# EAGLE design p7.1_3v3 (EAGLE 9.3.0)
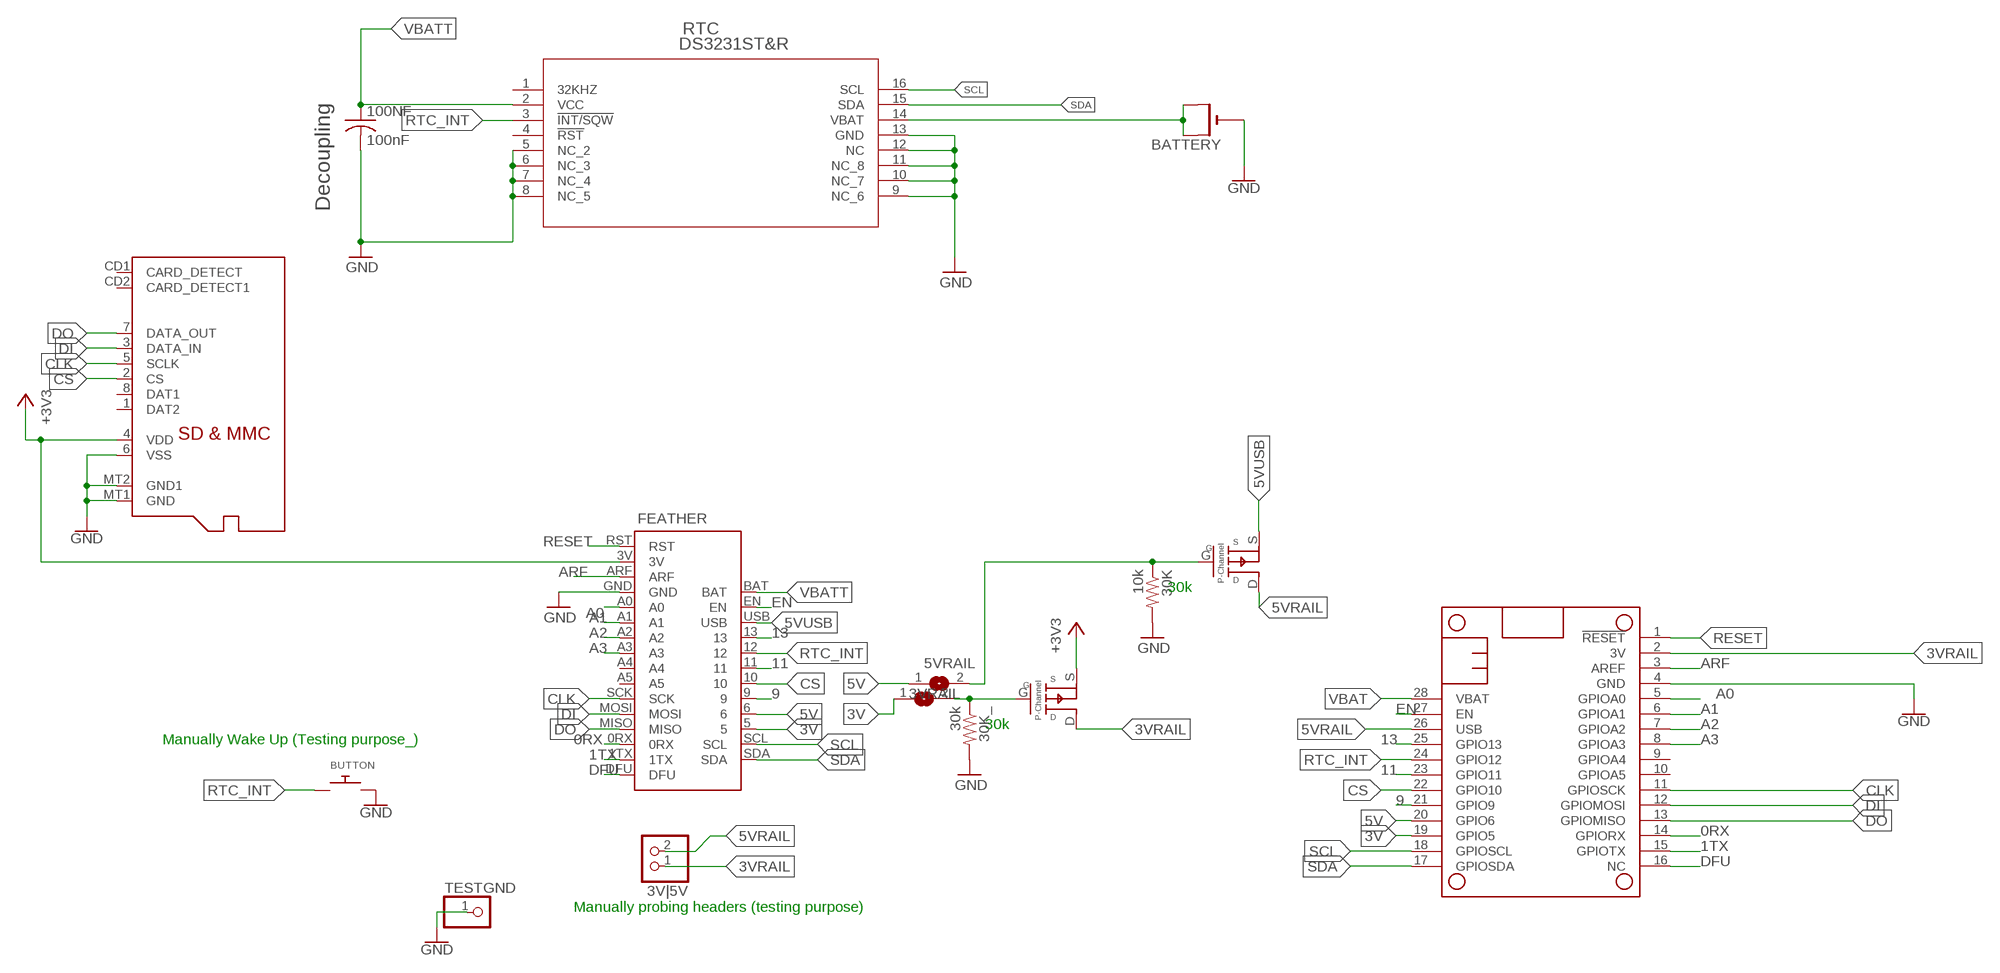
[diagram p0: schematic, sheet 1]

## Parts
3VRAIL  SJ  [SJ]
3V|5V  PINHD-1X2  [1X02]
5VRAIL  SJ  [SJ]
30K  10k  R-US_R1206  [R1206]
30K_  30k  R-US_R1206  [R1206]
100NF  100nF  C-USC1206  [C1206]
BATTERY  CR1220SMT  [CR1220-SMD]
BUTTON  SWITCH_PUSHBUTTONSOFTTOUCHSMD_SJ  [PUSHBUTTON_SMD_SJ]
FEATHER  BLUEFRUIT_M0  [BLUEFRUIT_MO]
MICROSD  MICROSD  [MICROSD]
MS1  FEATHERWING  [FEATHERWING]
PMOS  SSM3J3228R  [SOT-23-3]
PMOS_  SSM3J3228R  [SOT-23-3]
RTC  DS3231ST&R  [21-0042B_16]
TESTGND  PINHD-1X1  [1X01]

## Nets
0RX: FEATHER.0RX MS1.14(GPIORX)
1TX: FEATHER.1TX MS1.15(GPIOTX)
3V: 3VRAIL.1 FEATHER.5 MS1.19(GPIO5)
3VRAIL: 3V|5V.1 MS1.2(3V) PMOS.D
5V: 5VRAIL.1 FEATHER.6 MS1.20(GPIO6)
5VRAIL: 3V|5V.2 5VRAIL.2 30K.1 MS1.26(USB) PMOS_.D PMOS_.G
5VUSB: FEATHER.USB PMOS_.S
9: FEATHER.9 MS1.21(GPIO9)
11: FEATHER.11 MS1.23(GPIO11)
13: FEATHER.13 MS1.25(GPIO13)
+3V3: FEATHER.3V MICROSD.4(VDD) PMOS.S
A0: FEATHER.A0 MS1.5(GPIOA0)
A1: FEATHER.A1 MS1.6(GPIOA1)
A2: FEATHER.A2 MS1.7(GPIOA2)
A3: FEATHER.A3 MS1.8(GPIOA3)
ARF: FEATHER.ARF MS1.3(AREF)
CLK: FEATHER.SCK MICROSD.5(SCLK) MS1.11(GPIOSCK)
CS: FEATHER.10 MICROSD.2(CS) MS1.22(GPIO10)
DFU: FEATHER.DFU MS1.16(NC)
DI: FEATHER.MOSI MICROSD.3(DATA_IN) MS1.12(GPIOMOSI)
DO: FEATHER.MISO MICROSD.7(DATA_OUT) MS1.13(GPIOMISO)
EN: FEATHER.EN MS1.27(EN)
GND: 30K.2 30K_.2 100NF.2 BATTERY.- BUTTON.P$2 FEATHER.GND MICROSD.6(VSS) MICROSD.MT1(GND) MICROSD.MT2(GND1) MS1.4(GND) RTC.5(NC_2) RTC.6(NC_3) RTC.7(NC_4) RTC.8(NC_5) RTC.9(NC_6) RTC.10(NC_7) RTC.11(NC_8) RTC.12(NC) RTC.13(GND) TESTGND.1
N$2: BATTERY.+$1(+) BATTERY.+$2(+1) RTC.14(VBAT)
OUTPUT3V3: 3VRAIL.2 30K_.1 PMOS.G
RESET: FEATHER.RST MS1.1(!RESET)
RTC_INT [sig]: BUTTON.P$1 FEATHER.12 MS1.24(GPIO12) RTC.3(!INT/SQW)
SCL: FEATHER.SCL MS1.18(GPIOSCL) RTC.16(SCL)
SDA: FEATHER.SDA MS1.17(GPIOSDA) RTC.15(SDA)
VBAT [sig]: MS1.28(VBAT)
VBATT [sig]: 100NF.1 FEATHER.BAT RTC.2(VCC)
Unconnected: FEATHER.A4 FEATHER.A5 MICROSD.1(DAT2) MICROSD.8(DAT1) MICROSD.CD1(CARD_DETECT) MICROSD.CD2(CARD_DETECT1) MS1.9(GPIOA4) MS1.10(GPIOA5) RTC.1(32KHZ) RTC.4(!RST)

## Notes on the sheet
- Decoupling
- 30k
- 30k
- Manually Wake Up (Testing purpose_)
- Manually probing headers (testing purpose)

## Library data of the parts
3VRAIL 5VRAIL = jumper:SJ: SMD solder JUMPER
3V|5V = pinhead:PINHD-1X2: PIN HEADER
30K 30K_ = adafruit:R-US_: RESISTOR, American symbol
100NF = adafruit:C-US: CAPACITOR, American symbol
BATTERY = adafruit:CR1220: CR1216/CR1220/CR1225 12mm 3V lithium coin cell Great for battery packup. Both SMT and THM holders. Note the THM package has the ground pads on both sides of the PCB so that the masks are the same - this reduces the cost
BUTTON = adafruit:SWITCH_PUSHBUTTON: Buttons SOFTTOUCHSMD_SJ - Soft touch temporary push button (Super Junk Akihabara) Compatible with SKPMANE010 [Mouser: 688-SKPMAN] C&K_KSS = Digikey: KSS221GLFS
FEATHER = bluefruit_m0:BLUEFRUIT_M0: Adafruit's M0 Bluefruit / Bluetooth board layout
MICROSD = adafruit:MICROSD: Micro-SD / Transflash card holder with SPI pinout For the 3M # 2908-05WB-MG and/or 4UCON #19656 push-push type
MS1 = powerboard:FEATHERWING
PMOS PMOS_ = M0_Power:SSM3J3228R: P-Channel MOSFET, SOT-23-3 SMD Package
RTC = power8:DS3231ST&R: DS3231 RTC IC only; MANUFACTURER_PART_NUMBER: DS3231S#T&R; VENDOR: Maxim Integrated Products
TESTGND = adafruitmodified:PINHD-1X1: Pin header 1x1 for 0.1" spacing With round pins

## Net classes
3 sig: width 0.152 mm, clearance 0.152 mm

## Board
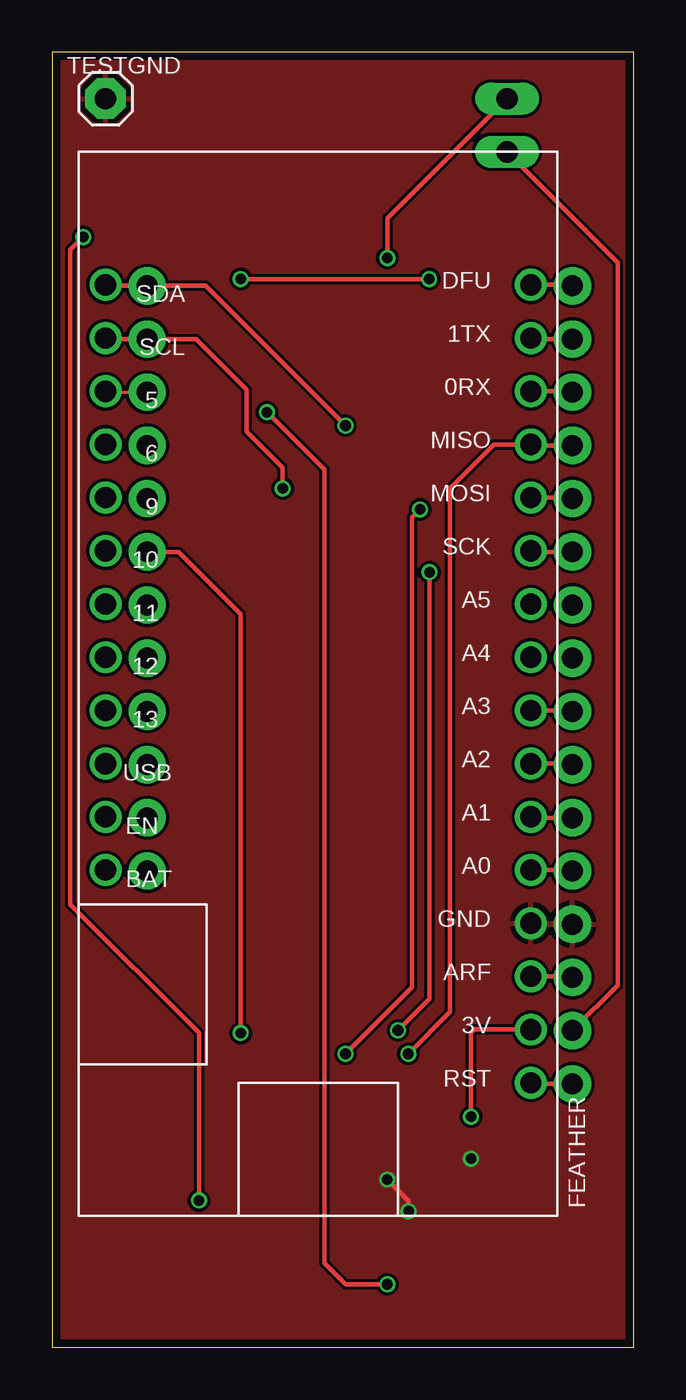
[diagram p1: board, top side]
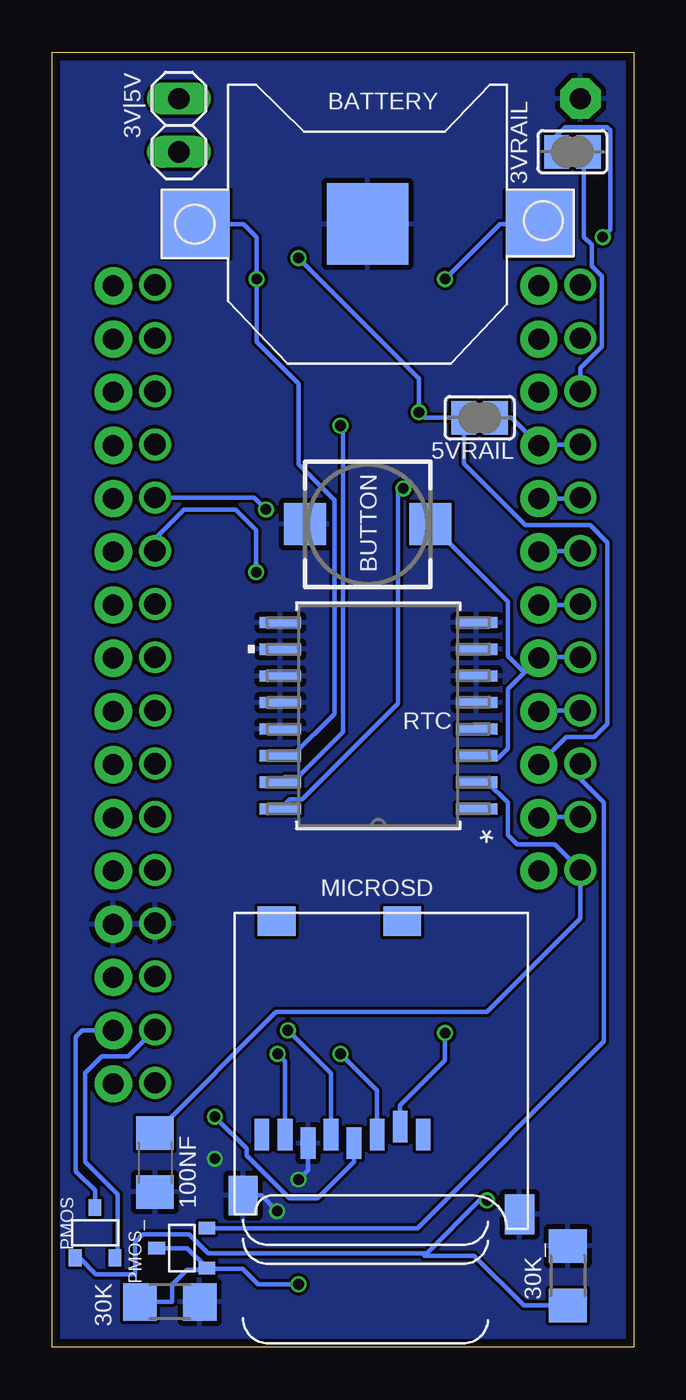
[diagram p2: board, bottom side, seen from below]

Size 27.76 x 61.82 mm. Coordinates in mm from the lower left corner, seen from the top.
Outline: 0,0 27.76,0 27.76,61.82 0,61.82 0,0
Copper layers (1*16): Top 0.035559375mm / dielectric 1.6mm / Bottom 0.035559375mm
Design rules "oshpark-2layer": minimum track width 6mil, minimum drill 10mil, track to track 6mil, track to pad 6mil, pad to pad 6mil, via to via 6mil, smd to smd 6mil, copper to edge 15mil, drill to drill 6mil, minimum pad ring 5mil, minimum via ring 5mil, stop-mask expansion 2.5mil, vias tented up to drill 0mil, thermal gap 10mil

### Footprints (pad centres in the part's own frame; a part is rotated, then mirrored left to right if it is on the bottom)
SJ = smd 1.168 x 1.6: 1 -0.762,0; 2 0.762,0
1X02 = drill 1.016 long: 1 -1.27,0; 2 1.27,0
R1206 = smd 1.6 x 1.803: 1 -1.422,0; 2 1.422,0
C1206 = smd 1.6 x 1.8: 1 -1.4,0; 2 1.4,0
CR1220-SMD = smd 3.2 x 3.2: +$1 -8.2,0; +$2 8.2,0 | smd 3.9 x 3.9: - 0,0
PUSHBUTTON_SMD_SJ = smd 2 x 2: P$1 3,0; P$2 -3,0
BLUEFRUIT_MO = drill 1.016: 0RX 39.37,1.27; 1TX 41.91,1.27; 3V 8.89,1.27; 5 39.37,21.59; 6 36.83,21.59; 9 34.29,21.59; 10 31.75,21.59; 11 29.21,21.59; 12 26.67,21.59; 13 24.13,21.59; A0 16.51,1.27; A1 19.05,1.27; A2 21.59,1.27; A3 24.13,1.27; A4 26.67,1.27; A5 29.21,1.27; ARF 11.43,1.27; BAT 16.51,21.59; DFU 44.45,1.27; EN 19.05,21.59; GND 13.97,1.27; MISO 36.83,1.27; MOSI 34.29,1.27; RST 6.35,1.27; SCK 31.75,1.27; SCL 41.91,21.59; SDA 44.45,21.59; USB 21.59,21.59
MICROSD = smd 0.7 x 1.5: 1 9,-10.64; 2 7.9,-10.24; 3 6.8,-10.64; 4 5.7,-11.04; 5 4.6,-10.64; 6 3.5,-11.04; 7 2.4,-10.64; 8 1.3,-10.64 | smd 1.8 x 1.4: CD1 2,-0.44; CD2 8,-0.44 | smd 1.4 x 1.9: MT1 0.4,-13.54; MT2 13.6,-14.44
FEATHERWING = drill 1 pad 1.778: 1 6.35,1.27; 2 8.89,1.27; 3 11.43,1.27; 4 13.97,1.27; 5 16.51,1.27; 6 19.05,1.27; 7 21.59,1.27; 8 24.13,1.27; 9 26.67,1.27; 10 29.21,1.27; 11 31.75,1.27; 12 34.29,1.27; 13 36.83,1.27; 14 39.37,1.27; 15 41.91,1.27; 16 44.45,1.27; 17 44.45,21.59; 18 41.91,21.59; 19 39.37,21.59; 20 36.83,21.59; 21 34.29,21.59; 22 31.75,21.59; 23 29.21,21.59; 24 26.67,21.59; 25 24.13,21.59; 26 21.59,21.59; 27 19.05,21.59; 28 16.51,21.59
SOT-23-3 = smd 0.8 x 0.6: D 1.2,0; G -1.2,0.95; S -1.2,-0.95
21-0042B_16 = smd 1.981 x 0.533: 1 -4.686,4.445; 2 -4.686,3.175; 3 -4.686,1.905; 4 -4.686,0.635; 5 -4.686,-0.635; 6 -4.686,-1.905; 7 -4.686,-3.175; 8 -4.686,-4.445; 9 4.686,-4.445; 10 4.686,-3.175; 11 4.686,-1.905; 12 4.686,-0.635; 13 4.686,0.635; 14 4.686,1.905; 15 4.686,3.175; 16 4.686,4.445
1X01 = drill 1.016 pad 1.93 octagon: 1 0,0

### Placement (x,y rotation side)
3VRAIL  2.92,57.07 180 bottom
3V|5V  21.72,58.34 90 bottom
5VRAIL  7.35,44.37 180 bottom
30K  22.15,2.15 0 bottom
30K_  3.14,3.41 90 bottom
100NF  22.86,8.81 270 bottom
BATTERY  12.7,53.62 0 bottom
BUTTON  12.7,39.29 0 bottom
FEATHER  24.13,6.27 90 top
MICROSD  19.05,20.78 0 bottom
MS1  26.12,6.22 90 top
PMOS  25.72,5.46 90 bottom
PMOS_  21.58,4.73 180 bottom
RTC  12.19,30.15 180 bottom
TESTGND  2.54,59.61 0 top

### Tracks (layer width: path | path; a pad name or v marks a point on that pad's centre or on a via)
0RX
  Top 0.203: FEATHER.0RX 24.8,45.64 MS1.14
1TX
  Top 0.203: FEATHER.1TX 22.91,48.13 MS1.15
3V
  Top 0.152: FEATHER.5 2.59,45.59 MS1.19
  Bottom 0.203: FEATHER.5 2.54,46.74 1.52,47.76 1.52,51.14 2,51.62 2,52.63 2.37,53 2.37,56.86 3VRAIL.1
3VRAIL
  Top 0.203: 3V|5V.1 27,51.79 27,17.27 MS1.2
  Bottom 0.203: MS1.2 26.34,15.11 26.64,14.81 26.64,8.4 25.72,7.48 PMOS.D
5V
  Bottom 0.203: FEATHER.6 4.48,43.1 MS1.20 5.84,44.37 5VRAIL.1
5VRAIL  (via drill 0.51)
  Top 0.203: v10.25,44.64 13,41.89 13,4 14,3 v16,3 | 3V|5V.2 16,53.89 v16,52
  Bottom 0.203: MS1.26 3.21,29.13 1.86,29.13 1.25,29.75 1.25,38.42 2.07,39.24 5.17,39.24 8.11,42.18 5VRAIL.2 9.98,44.37 v10.25,44.64 10.25,46.25 v16,52 | 30K.1 22.03,2.15 22.03,3 22.01,3 21.32,3.69 20.46,3.69 PMOS_.G | PMOS_.G 21.33,4.73 PMOS_.D | v16,3 17.94,3 18.67,3.73 20.33,3.73 PMOS_.G
5VUSB
  Bottom 0.203: FEATHER.USB 2.54,27.14 1.41,26.01 1.41,14.59 10.32,5.68 PMOS_.S
9
  Bottom 0.203: FEATHER.9 2.59,40.51 MS1.21
11
  Bottom 0.203: FEATHER.11 2.59,35.43 MS1.23
13
  Bottom 0.203: FEATHER.13 4.48,30.4 MS1.25
+3V3  (via drill 0.51)
  Top 0.203: v20,11 20,15 20.16,15.16 FEATHER.3V
  Bottom 0.203: FEATHER.3V 24.13,13.89 25.4,13.89 26.2,13.09 26.2,8.84 24.64,7.29 24.64,4.39 PMOS.S | MICROSD.4 13.35,8.85 15.09,7.11 16.43,7.11 18.48,9.16 18.48,9.48 v20,11
A0
  Top 0.203: FEATHER.A0 24.8,22.78 MS1.5
A1
  Top 0.203: FEATHER.A1 22.91,25.27 MS1.6
A2
  Top 0.203: FEATHER.A2 24.8,27.86 MS1.7
A3
  Top 0.203: FEATHER.A3 24.8,30.4 MS1.8
ARF
  Top 0.203: FEATHER.ARF 24.8,17.7 MS1.3
CLK  (via drill 0.51)
  Top 0.203: FEATHER.SCK 22.91,37.97 MS1.11 | v16.51,15.12 18.02,16.63 v18.02,37
  Bottom 0.203: MICROSD.5 14.45,13.06 v16.51,15.12 | v18.02,37 18.02,39.02 19,40 21.48,40 22.86,38.62 FEATHER.SCK
CS  (via drill 0.51)
  Top 0.203: v9,15 9,35 6.03,37.97 MS1.22
  Bottom 0.203: MICROSD.2 11.15,11.54 9,13.69 v9,15 | FEATHER.10 4.48,38.02 MS1.22
DFU
  Top 0.203: FEATHER.DFU 24.8,50.72 MS1.16
DI  (via drill 0.51)
  Top 0.203: FEATHER.MOSI 24.8,40.56 MS1.12 | v14,14 17.18,17.18 17.18,39.62 v17.56,40
  Bottom 0.203: MICROSD.3 12.25,12.25 v14,14 | v17.56,40 18.12,40.56 FEATHER.MOSI
DO  (via drill 0.51)
  Top 0.203: MS1.13 22.91,43.05 FEATHER.MISO 21.1,43.1 19,41 19,16 v17,14
  Bottom 0.203: MICROSD.7 16.65,13.65 v17,14
EN
  Bottom 0.203: FEATHER.EN 4.48,25.32 MS1.27
GND  (via drill 0.51)
  Top 0.203: v16,8 17.02,6.98 v17.02,6.49
  Bottom 0.203: MICROSD.6 15.55,8.45 v16,8 | v17.02,6.49 17.77,7.24 MICROSD.MT1
  other vias: 20,9
  pour Top: 0,62 0,0 28,0 28,62
  pour Bottom: 0,62 0,0 28,0 28,62
N$2  (via drill 0.51)
  Top 0.203: v9,51 v18,51
  Bottom 0.203: BATTERY.+$2 6.38,53.62 v9,51 | BATTERY.+$1 18.62,53.62 18,53 v18,51 18,48 16,46 16,42.16 14.29,40.45 14.29,30.23 16.28,28.24 RTC.14
OUTPUT3V3  (via drill 0.51)
  Top 0.203: v7,7 7,15 0.86,21.14 0.86,52.39 v1.47,53
  Bottom 0.203: PMOS.G 26.46,4.26 25.68,3.48 23.81,3.48 23.81,5.01 23.44,5.38 21.22,5.38 20.33,4.49 9.87,4.49 | 30K_.1 5.25,1.99 7.62,4.37 10,4.37 9.87,4.49 | 9.87,4.49 7.37,7 v7,7 | 3VRAIL.2 3.68,57.83 3.26,58.25 1.27,58.25 1.12,58.1 1.12,53.36 v1.47,53
RESET
  Top 0.203: FEATHER.RST 22.91,12.57 MS1.1
RTC_INT
  Bottom 0.203: FEATHER.12 4.48,32.94 MS1.24 5.21,32.21 | 5.21,32.21 6,31.42 6,28.59 6.48,28.11 6.6,28.24 RTC.3 | BUTTON.P$1 6,35.59 6,33 5.21,32.21
SCL  (via drill 0.51)
  Top 0.203: FEATHER.SCL 2.59,48.13 MS1.18 6.87,48.13 9.29,45.71 9.29,43.71 11,41.99 v11,41
  Bottom 0.203: RTC.16 16.43,26.15 15.83,26.15 11.25,30.73 11.25,40.75 v11,41
SDA  (via drill 0.51)
  Top 0.203: FEATHER.SDA 2.59,50.67 MS1.17 7.33,50.67 v14,44
  Bottom 0.203: RTC.15 16.64,27.21 16.04,27.21 13.87,29.38 13.87,43.87 v14,44
VBATT
  Bottom 0.203: RTC.2 6.97,26.97 6,26 6,24.46 5.54,24 3.76,24 FEATHER.BAT 2.54,20.46 7,16 17.07,16 100NF.1